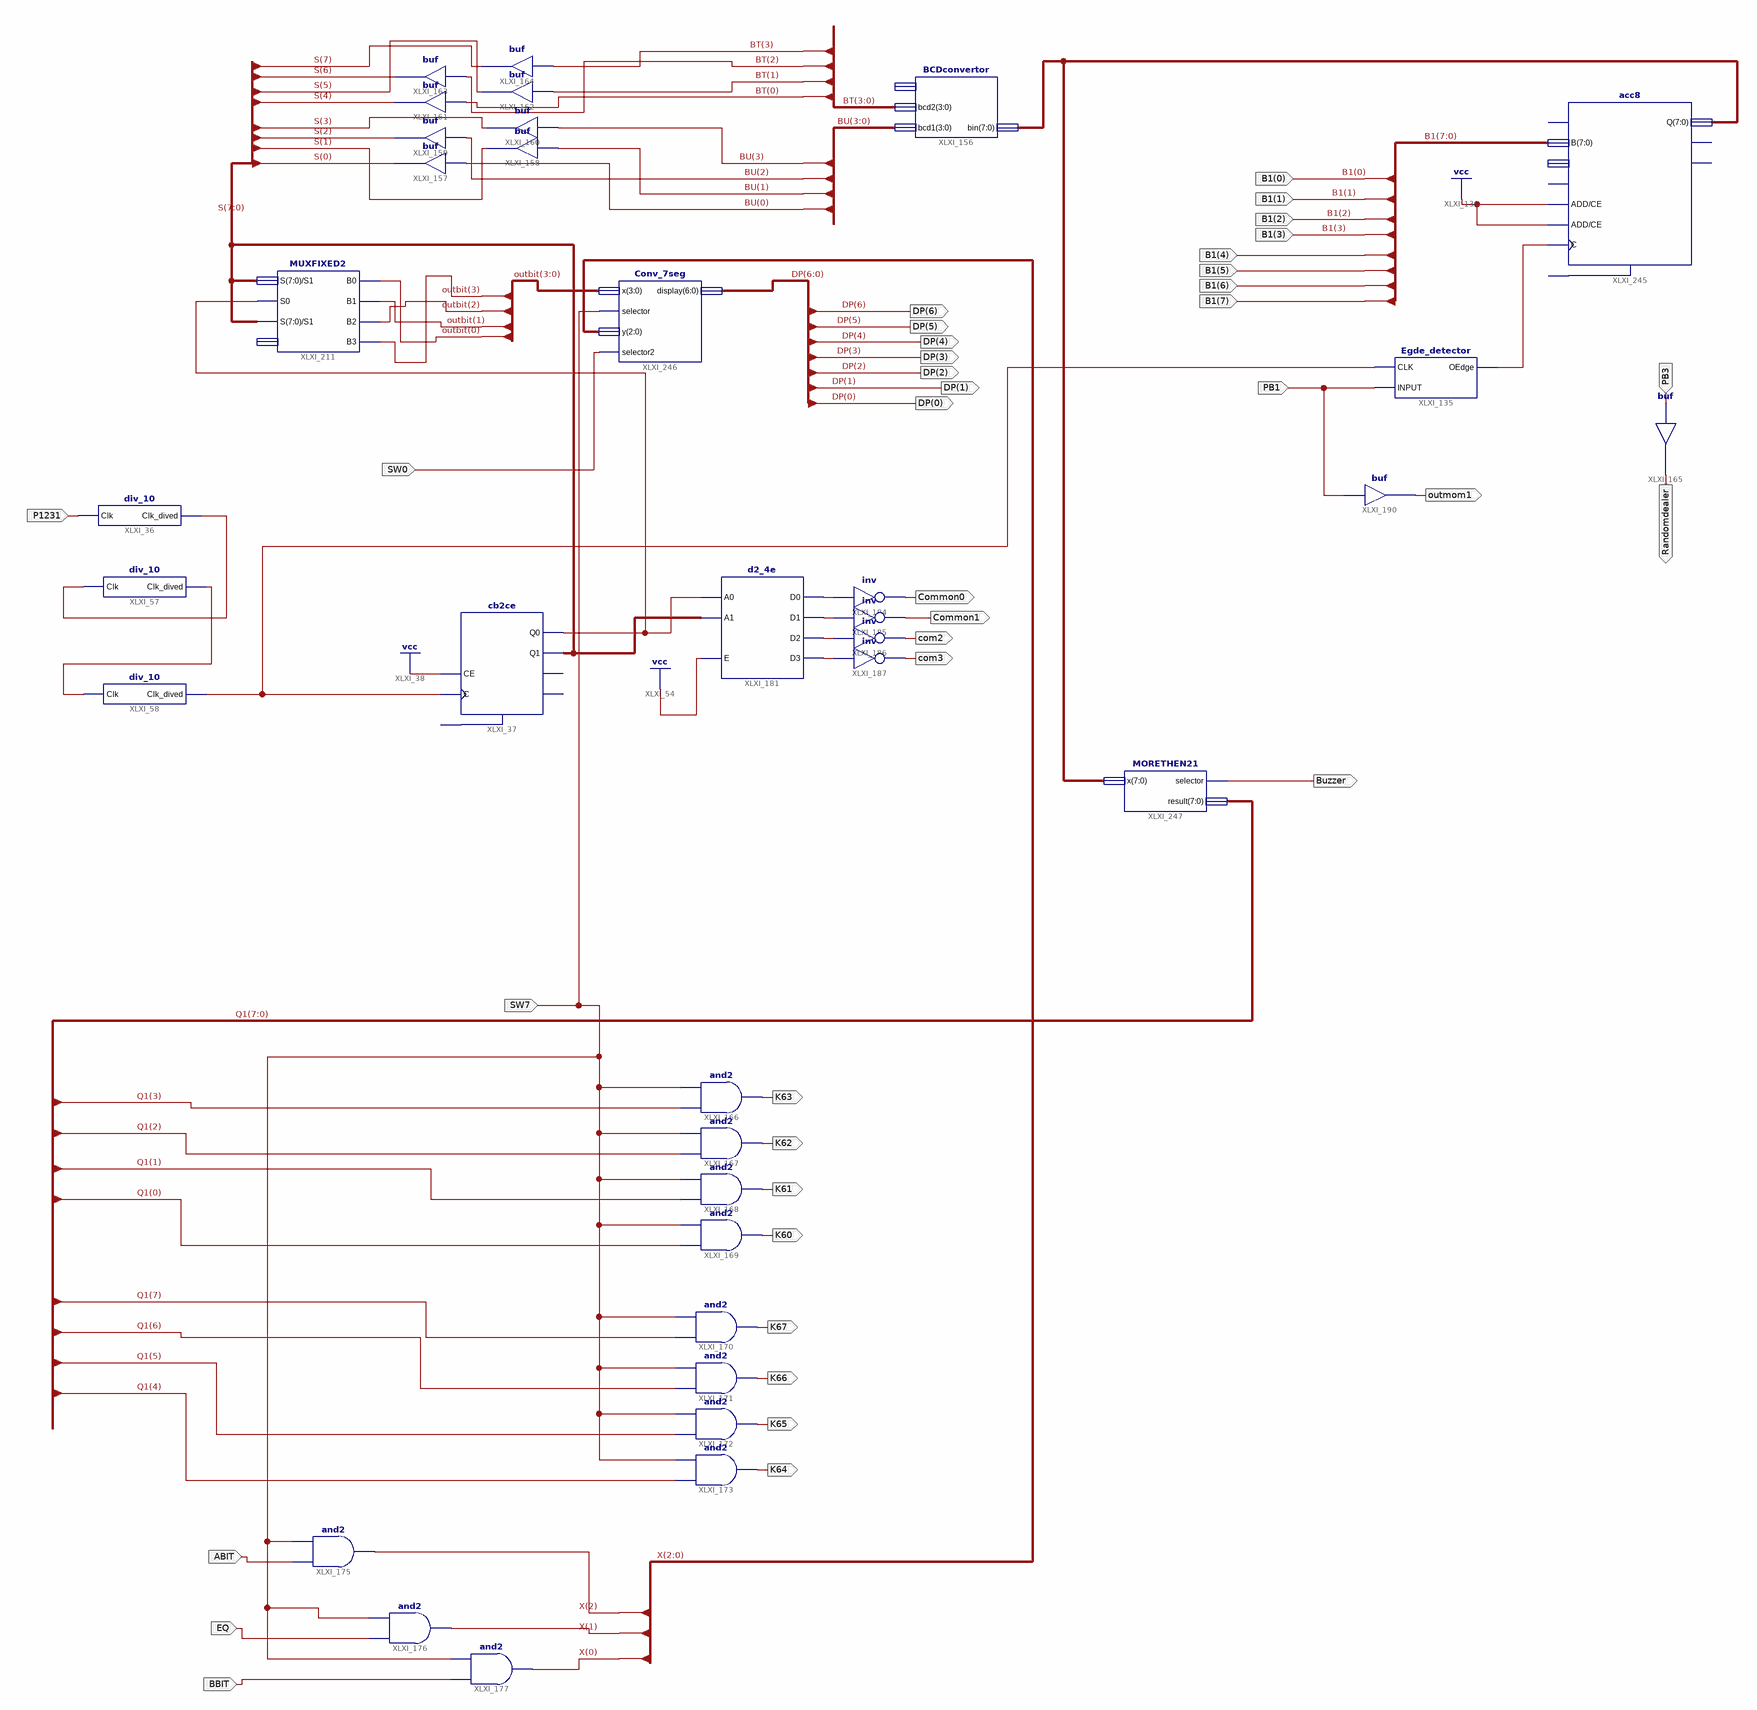
[diagram p0: schematic sheet 1]
// Xilinx ISE schematic Main.sch (spartan6) as structural Verilog: 36 symbols, 38 ports
module Main (
  input  P1231,
  input  [7:0] B1,
  input  PB1,
  input  SW7,
  input  ABIT,
  input  EQ,
  input  BBIT,
  input  SW0,
  input  PB3,
  output [6:0] DP,
  output K60,
  output K61,
  output K62,
  output K63,
  output K64,
  output K65,
  output K66,
  output K67,
  output Common0,
  output Common1,
  output com2,
  output com3,
  output outmom1,
  output Buzzer,
  output Randomdealer
);

  wire XLXN_208, XLXN_209, XLXN_653, XLXN_654, XLXN_655, XLXN_656, XLXN_724, XLXN_728, XLXN_855;
  wire [2:0] X;
  wire [3:0] BT, BU, outbit;
  wire [7:0] Q1, S, XLXN_894;

  cb2ce XLXI_37 (.C(XLXN_724), .CE(1'b1), .Q0(XLXN_728), .Q1(S));  // open: CLR, CEO, TC
  div_10 XLXI_36 (.Clk(P1231), .Clk_dived(XLXN_208));
  div_10 XLXI_57 (.Clk(XLXN_208), .Clk_dived(XLXN_209));
  div_10 XLXI_58 (.Clk(XLXN_209), .Clk_dived(XLXN_724));
  Egde_detector XLXI_135 (.CLK(XLXN_724), .INPUT(PB1), .OEdge(XLXN_855));
  BCDconvertor XLXI_156 (.bin(XLXN_894), .bcd1(BU), .bcd2(BT));  // open: bcd3
  buf XLXI_157 (S[0], BU[0]);
  buf XLXI_159 (S[2], BU[2]);
  buf XLXI_161 (S[4], BT[0]);
  buf XLXI_163 (S[6], BT[2]);
  buf XLXI_158 (S[1], BU[1]);
  buf XLXI_160 (S[3], BU[3]);
  buf XLXI_162 (S[5], BT[1]);
  buf XLXI_164 (S[7], BT[3]);
  and XLXI_166 (K63, Q1[3], SW7);
  and XLXI_167 (K62, Q1[2], SW7);
  and XLXI_168 (K61, Q1[1], SW7);
  and XLXI_169 (K60, Q1[0], SW7);
  and XLXI_170 (K67, Q1[7], SW7);
  and XLXI_171 (K66, Q1[6], SW7);
  and XLXI_172 (K65, Q1[5], SW7);
  and XLXI_173 (K64, Q1[4], SW7);
  and XLXI_175 (X[2], ABIT, SW7);
  and XLXI_176 (X[1], EQ, SW7);
  and XLXI_177 (X[0], BBIT, SW7);
  d2_4e XLXI_181 (.A0(XLXN_728), .A1(S), .E(1'b1), .D0(XLXN_653), .D1(XLXN_654), .D2(XLXN_655), .D3(XLXN_656));
  not XLXI_184 (Common0, XLXN_653);
  not XLXI_185 (Common1, XLXN_654);
  not XLXI_186 (com2, XLXN_655);
  not XLXI_187 (com3, XLXN_656);
  buf XLXI_190 (outmom1, PB1);
  MUXFIXED2 XLXI_211 (
    .S(S), .S0(XLXN_728), .S1(S), .B0(outbit[0]), .B1(outbit[1]), .B2(outbit[2]), .B3(outbit[3]));  // open: Hidecard
  acc8 XLXI_245 (.ADD(1'b1), .B(B1), .C(XLXN_855), .CE(1'b1), .Q(XLXN_894));  // open: CI, D, L, R, CO, OFL
  Conv_7seg XLXI_246 (.selector(SW7), .x(outbit), .y(X), .display(DP), .selector2(SW0));
  MORETHEN21 XLXI_247 (.x(XLXN_894), .selector(Buzzer), .result(Q1));
  buf XLXI_165 (Randomdealer, PB3);
endmodule
